# Altium schematic sheet 08-multimodal-microcontroller-switches-display.SchDoc
size A; SheetNumber: 9; SheetTotal: 12
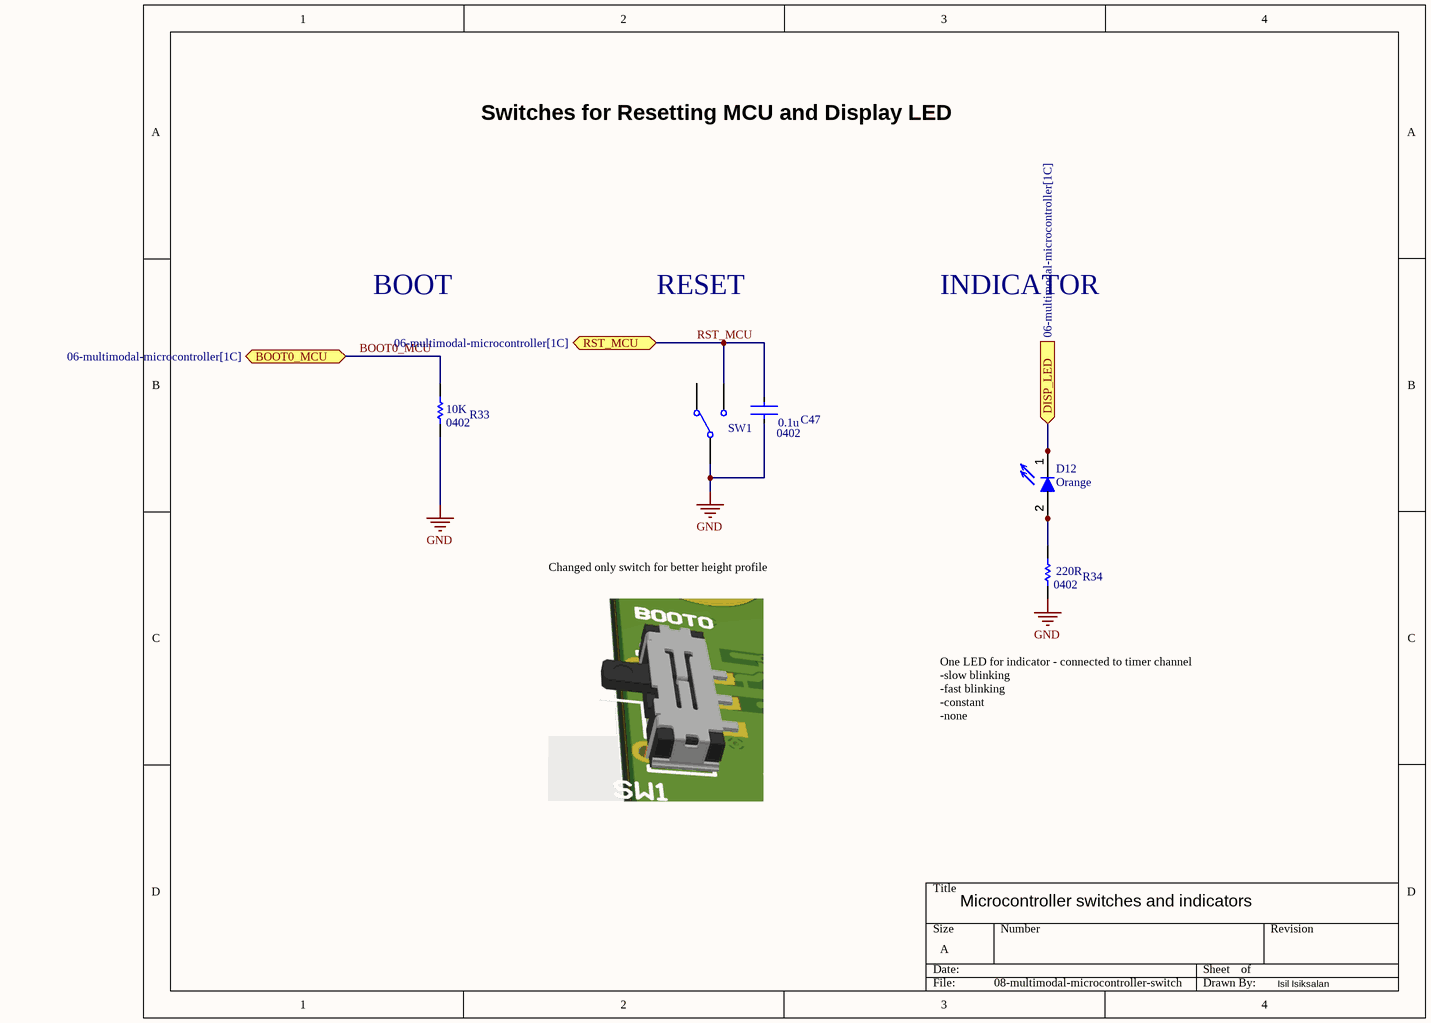
[diagram p0: 08-multimodal-microcontroller-switches-display.SchDoc]

## Parts
C47  C1005X7R1H104K050BB  [CAPTDK0402]  (value not drawn)
D12  Orange  [DISPLAY-LED]
R33  RMCF0402FT10K0  [RES-STACK-POLE-0402]  (value not drawn)
R34  RMCF0402JT220R  [RES-STACK-POLE-0402]  (value not drawn)
SW1  450405020524  [450405020524]  (value not drawn)

## Ports
BOOT0_MCU (bidir, see 06-multimodal-microcontroller[1C]), DISP_LED (in, see 06-multimodal-microcontroller[1C]), RST_MCU (bidir, see 06-multimodal-microcontroller[1C])

## Nets
GND: C47.2 R33.1 R34.1 SW1.COM
BOOT0_MCU: R33.2 ; port BOOT0_MCU
DISP_LED: D12.1 ; port DISP_LED
RST_MCU: C47.1 SW1.L2 ; port RST_MCU
NetD12_2: D12.2 R34.2

Not connected (* = marked no-connect by the designer): SW1 L1

## Notes on the sheet
- Switches for Resetting MCU and Display LED
- BOOT
- RESET
- INDICATOR
- Changed only switch for better height profile
- One LED for indicator - connected to timer channel
  -slow blinking
  -fast blinking
  -constant
  -none
- Microcontroller switches and indicators
- Isil Isiksalan
- (in symbol C1005X7R1H104K050BB) 0.1u; 0402
- (in symbol RMCF0402FT10K0) 10K; 0402
- (in symbol RMCF0402JT220R) 220R; 0402

## Library data of the parts
C47 = C1005X7R1H104K050BB: CAP CER 0.1UF 50V X7R 0402; Supplier 1: Digi-Key; Supplier Part Number 1: 445-5932-1-ND
D12 = LTST-C191KFKT: LED ORANGE CLEAR 0603 SMD; Supplier 1: Digi-Key; Supplier Part Number 1: 160-1445-1-ND
R33 = RMCF0402FT10K0: RES 10K OHM 1% 1/16W 0402; Supplier 1: Digi-Key; Supplier Part Number 1: RMCF0402FT10K0CT-ND
R34 = RMCF0402JT220R: RES 220 OHM 5% 1/16W 0402; Supplier 1: Digi-Key; Supplier Part Number 1: RMCF0402JT220RCT-ND
SW1 = 450405020524: WS-SLSU SMT Mini Slide Switch Same Side Connection, SPDT, 5VDC, 300mA, 225g; Manufacturer: Wurth Elektronik; ComponentLink1Description: Website Link; ComponentLink1URL: https://www.we-online.com/redexpert/article/450405020524?ad; ComponentLink2Description: Datasheet Link; ComponentLink2URL: https://www.we-online.com/redexpert/spec/450405020524?ad; Manufacturer Part Number: 450405020524; Category: Slide Switches; Match Code: WS-SLSU; Mount: Surface Mount; Operating Temperature Max: 85°C; Operating Temperature Min: -40°C; Packaging: Tape and Reel; Length: 8.7mm; Width: 3mm; Height: 2mm; Circuit: SPDT; Contact Material: Copper Alloy; Contact Plating: Silver; Operation Force: 225g; Rated Current: 300mA; Rated Voltage: 5VDC; Terminal Material: Copper Alloy; Terminal Plating: Silver